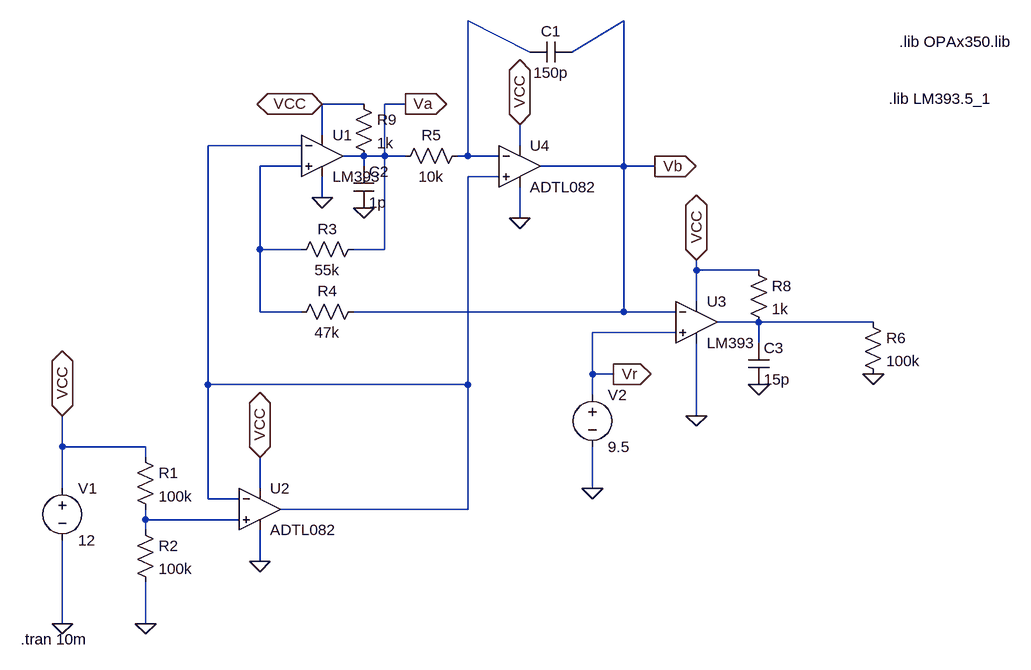
[diagram p0: schematic pwm_funciona_5_6.asc]
pwm_funciona_5_6.asc, the LTspice schematic file:
Version 4
SHEET 1 2200 680
WIRE -32 -896 -128 -944
WIRE 32 -896 112 -944
WIRE -288 -816 -352 -816
WIRE -224 -816 -256 -816
WIRE -352 -768 -352 -816
WIRE -384 -752 -528 -752
WIRE -48 -752 -48 -784
WIRE -288 -736 -320 -736
WIRE -256 -736 -256 -816
WIRE -256 -736 -288 -736
WIRE -224 -736 -256 -736
WIRE -128 -736 -128 -944
WIRE -128 -736 -144 -736
WIRE -80 -736 -128 -736
WIRE -384 -720 -448 -720
WIRE -288 -720 -288 -736
WIRE 112 -720 112 -944
WIRE 112 -720 -16 -720
WIRE 160 -720 112 -720
WIRE -80 -704 -128 -704
WIRE -352 -672 -352 -704
WIRE -48 -640 -48 -688
WIRE -448 -592 -448 -720
WIRE -384 -592 -448 -592
WIRE -256 -592 -256 -736
WIRE -256 -592 -304 -592
WIRE 224 -560 224 -576
WIRE 320 -560 224 -560
WIRE 224 -512 224 -560
WIRE -448 -496 -448 -592
WIRE -384 -496 -448 -496
WIRE 112 -496 112 -720
WIRE 112 -496 -304 -496
WIRE 192 -496 112 -496
WIRE 320 -480 256 -480
WIRE 496 -480 320 -480
WIRE 192 -464 64 -464
WIRE 320 -448 320 -480
WIRE 64 -400 64 -464
WIRE 96 -400 64 -400
WIRE -528 -384 -528 -752
WIRE -128 -384 -128 -704
WIRE -128 -384 -528 -384
WIRE 64 -368 64 -400
WIRE 224 -336 224 -448
WIRE -752 -288 -752 -336
WIRE -624 -288 -752 -288
WIRE -624 -272 -624 -288
WIRE -752 -224 -752 -288
WIRE -448 -224 -448 -272
WIRE 64 -224 64 -288
WIRE -528 -208 -528 -384
WIRE -480 -208 -528 -208
WIRE -128 -192 -128 -384
WIRE -128 -192 -416 -192
WIRE -624 -176 -624 -192
WIRE -480 -176 -624 -176
WIRE -624 -160 -624 -176
WIRE -448 -112 -448 -160
WIRE -752 -16 -752 -144
WIRE -624 -16 -624 -80
FLAG -624 -16 0
FLAG -752 -16 0
FLAG -448 -112 0
FLAG 224 -336 0
FLAG -352 -672 0
FLAG -752 -336 VCC
IOPIN -752 -336 BiDir
FLAG -448 -272 VCC
IOPIN -448 -272 BiDir
FLAG -224 -816 Va
IOPIN -224 -816 Out
FLAG 160 -720 Vb
IOPIN 160 -720 Out
FLAG 64 -224 0
FLAG 96 -400 Vr
IOPIN 96 -400 Out
FLAG 496 -400 0
FLAG -352 -816 VCC
IOPIN -352 -816 BiDir
FLAG 224 -576 VCC
IOPIN 224 -576 BiDir
FLAG -48 -640 0
FLAG -48 -784 VCC
IOPIN -48 -784 BiDir
FLAG -288 -656 0
FLAG 320 -384 0
SYMBOL res -128 -752 R90
WINDOW 0 0 56 VBottom 2
WINDOW 3 32 56 VTop 2
SYMATTR InstName R5
SYMATTR Value 10k
SYMBOL res -640 -288 R0
SYMATTR InstName R1
SYMATTR Value 100k
SYMBOL res -640 -176 R0
SYMATTR InstName R2
SYMATTR Value 100k
SYMBOL voltage -752 -240 R0
WINDOW 123 0 0 Left 0
WINDOW 39 0 0 Left 0
SYMATTR InstName V1
SYMATTR Value 12
SYMBOL res -288 -608 R90
WINDOW 0 0 56 VBottom 2
WINDOW 3 32 56 VTop 2
SYMATTR InstName R3
SYMATTR Value 55k
SYMBOL res -288 -512 R90
WINDOW 0 0 56 VBottom 2
WINDOW 3 32 56 VTop 2
SYMATTR InstName R4
SYMATTR Value 47k
SYMBOL voltage 64 -384 R0
WINDOW 123 0 0 Left 0
WINDOW 39 0 0 Left 0
SYMATTR InstName V2
SYMATTR Value 9.5
SYMBOL cap 32 -912 R90
WINDOW 0 0 32 VBottom 2
WINDOW 3 32 32 VTop 2
SYMATTR InstName C1
SYMATTR Value 150p
SYMBOL OpAmps\\opamp2 224 -544 R0
SYMATTR InstName U3
SYMATTR Value LM393
SYMBOL OpAmps\\opamp2 -352 -800 R0
SYMATTR InstName U1
SYMATTR Value LM393
SYMBOL res 304 -576 R0
SYMATTR InstName R8
SYMATTR Value 1k
SYMBOL res -304 -832 R0
SYMATTR InstName R9
SYMATTR Value 1k
SYMBOL res 480 -496 R0
SYMATTR InstName R6
SYMATTR Value 100k
SYMBOL OpAmps\\ADTL082 -48 -784 R0
SYMATTR InstName U4
SYMBOL OpAmps\\ADTL082 -448 -256 R0
SYMATTR InstName U2
SYMBOL cap -304 -720 R0
SYMATTR InstName C2
SYMATTR Value 1p
SYMBOL cap 304 -448 R0
SYMATTR InstName C3
SYMATTR Value 15p
TEXT -816 8 Left 2 !.tran 10m
TEXT 536 -912 Left 2 !.lib OPAx350.lib
TEXT 520 -824 Left 2 !.lib LM393.5_1

The netlist it stands for:
* pwm_funciona_5_6.asc
R5 N001 Va 10k
R1 VCC N005 100k
R2 N005 0 100k
V1 VCC 0 12
R3 Va N003 55k
R4 Vb N003 47k
V2 Vr 0 9.5
C1 Vb N001 150p
XU3 Vr Vb VCC 0 N004 LM393  ; pins In+ In- V+ V- OUT
XU1 N003 N002 VCC 0 Va LM393  ; pins In+ In- V+ V- OUT
R8 VCC N004 1k
R9 VCC Va 1k
R6 N004 0 100k
XU4 N002 N001 VCC 0 Vb ADTL082  ; pins In+ In- V+ V- OUT
XU2 N005 N002 VCC 0 N002 ADTL082  ; pins In+ In- V+ V- OUT
C2 Va 0 1p
C3 N004 0 15p
.tran 10m
.lib OPAx350.lib
.lib LM393.5_1
.lib ADI.lib
.backanno
.end